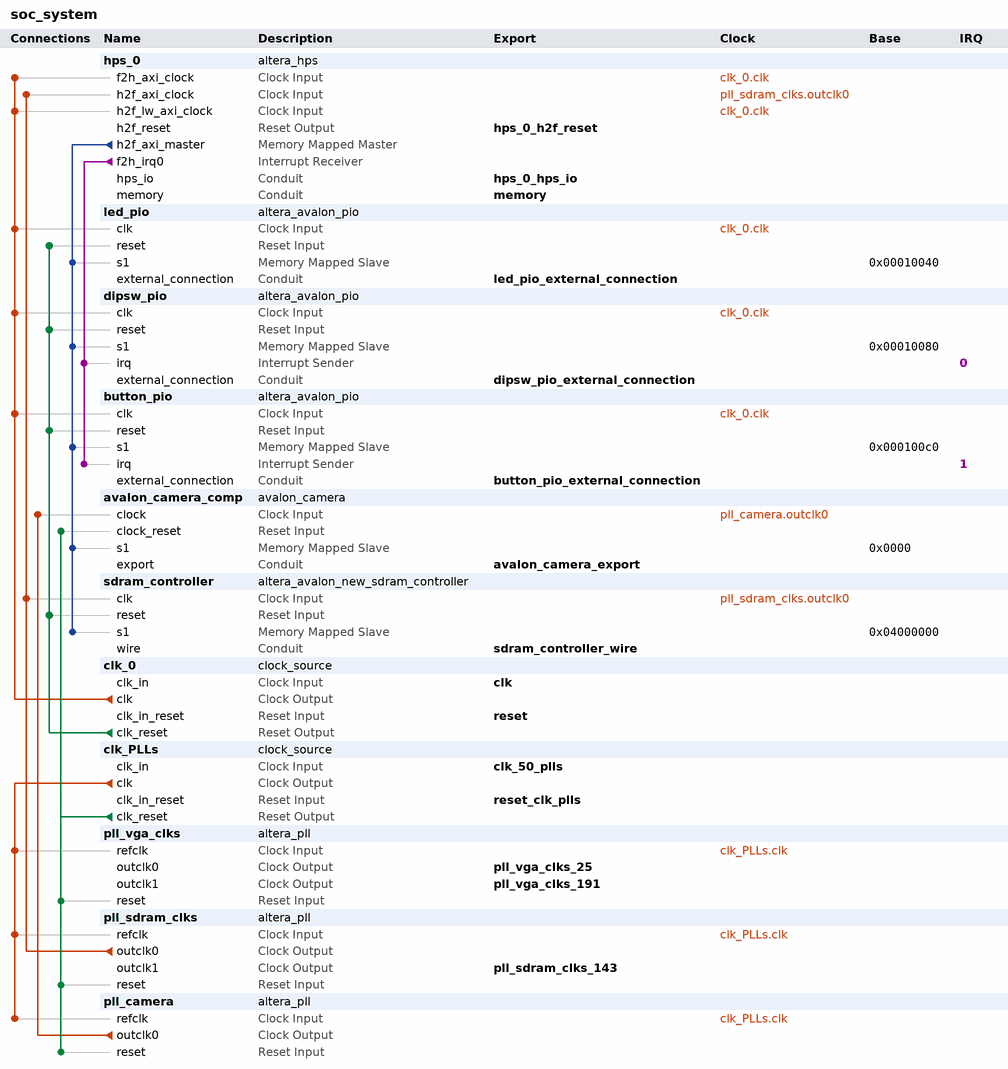
[diagram p0: system contents]
# Platform Designer (Qsys) system soc_system, Cyclone V 5CSEMA5F31C6
# Parameters at their usual value, and those the tool derives, are not listed.
package require -exact qsys 16.0
create_system soc_system
set_project_property DEVICE_FAMILY {Cyclone V}
set_project_property DEVICE 5CSEMA5F31C6

add_instance hps_0 altera_hps 16.0
set_instance_parameter_value hps_0 EMAC1_Mode RGMII
set_instance_parameter_value hps_0 EMAC1_PinMuxing {HPS I/O Set 0}
set_instance_parameter_value hps_0 F2SCLK_COLDRST_Enable false
set_instance_parameter_value hps_0 F2SCLK_DBGRST_Enable false
set_instance_parameter_value hps_0 F2SCLK_WARMRST_Enable false
set_instance_parameter_value hps_0 F2SINTERRUPT_Enable true
set_instance_parameter_value hps_0 F2S_Width 2
set_instance_parameter_value hps_0 FPGA_PERIPHERAL_OUTPUT_CLOCK_FREQ_EMAC0_GTX_CLK 100
set_instance_parameter_value hps_0 FPGA_PERIPHERAL_OUTPUT_CLOCK_FREQ_EMAC0_MD_CLK 100.0
set_instance_parameter_value hps_0 FPGA_PERIPHERAL_OUTPUT_CLOCK_FREQ_EMAC1_GTX_CLK 100
set_instance_parameter_value hps_0 FPGA_PERIPHERAL_OUTPUT_CLOCK_FREQ_EMAC1_MD_CLK 100.0
set_instance_parameter_value hps_0 HPS_PROTOCOL DDR3
set_instance_parameter_value hps_0 I2C0_Mode I2C
set_instance_parameter_value hps_0 I2C0_PinMuxing {HPS I/O Set 0}
set_instance_parameter_value hps_0 I2C1_Mode I2C
set_instance_parameter_value hps_0 I2C1_PinMuxing {HPS I/O Set 0}
set_instance_parameter_value hps_0 LWH2F_Enable true
set_instance_parameter_value hps_0 MEM_BANKADDR_WIDTH 3
set_instance_parameter_value hps_0 MEM_CLK_FREQ 400.0
set_instance_parameter_value hps_0 MEM_COL_ADDR_WIDTH 10
set_instance_parameter_value hps_0 MEM_DQ_WIDTH 32
set_instance_parameter_value hps_0 MEM_DRV_STR RZQ/7
set_instance_parameter_value hps_0 MEM_ROW_ADDR_WIDTH 15
set_instance_parameter_value hps_0 MEM_RTT_NOM RZQ/4
set_instance_parameter_value hps_0 MEM_RTT_WR RZQ/4
set_instance_parameter_value hps_0 MEM_TCL 11
set_instance_parameter_value hps_0 MEM_TFAW_NS 30.0
set_instance_parameter_value hps_0 MEM_TRAS_NS 35.0
set_instance_parameter_value hps_0 MEM_TRCD_NS 13.75
set_instance_parameter_value hps_0 MEM_TRFC_NS 260.0
set_instance_parameter_value hps_0 MEM_TRP_NS 13.75
set_instance_parameter_value hps_0 MEM_VENDOR Micron
set_instance_parameter_value hps_0 MEM_WTCL 8
set_instance_parameter_value hps_0 QSPI_Mode {1 SS}
set_instance_parameter_value hps_0 QSPI_PinMuxing {HPS I/O Set 0}
set_instance_parameter_value hps_0 REF_CLK_FREQ 25.0
set_instance_parameter_value hps_0 S2FCLK_USER2CLK 5
set_instance_parameter_value hps_0 S2F_Width 3
set_instance_parameter_value hps_0 SDIO_Mode {4-bit Data}
set_instance_parameter_value hps_0 SDIO_PinMuxing {HPS I/O Set 0}
set_instance_parameter_value hps_0 SPIM1_Mode {Single Slave Select}
set_instance_parameter_value hps_0 SPIM1_PinMuxing {HPS I/O Set 0}
set_instance_parameter_value hps_0 STM_Enable false
set_instance_parameter_value hps_0 TIMING_BOARD_AC_SKEW 0.02
set_instance_parameter_value hps_0 TIMING_BOARD_AC_TO_CK_SKEW 0.01
set_instance_parameter_value hps_0 TIMING_BOARD_DQ_TO_DQS_SKEW 0.05
set_instance_parameter_value hps_0 TIMING_BOARD_MAX_CK_DELAY 0.03
set_instance_parameter_value hps_0 TIMING_BOARD_MAX_DQS_DELAY 0.02
set_instance_parameter_value hps_0 TIMING_BOARD_SKEW_BETWEEN_DQS 0.06
set_instance_parameter_value hps_0 TIMING_BOARD_SKEW_CKDQS_DIMM_MAX 0.12
set_instance_parameter_value hps_0 TIMING_BOARD_SKEW_CKDQS_DIMM_MIN 0.06
set_instance_parameter_value hps_0 TIMING_BOARD_SKEW_WITHIN_DQS 0.01
set_instance_parameter_value hps_0 TIMING_TDH 65
set_instance_parameter_value hps_0 TIMING_TDQSCK 255
set_instance_parameter_value hps_0 TIMING_TDQSQ 125
set_instance_parameter_value hps_0 TIMING_TDS 30
set_instance_parameter_value hps_0 TIMING_TIH 140
set_instance_parameter_value hps_0 TIMING_TIS 180
set_instance_parameter_value hps_0 TIMING_TQSH 0.4
set_instance_parameter_value hps_0 UART0_Mode {No Flow Control}
set_instance_parameter_value hps_0 UART0_PinMuxing {HPS I/O Set 0}
set_instance_parameter_value hps_0 USB1_Mode SDR
set_instance_parameter_value hps_0 USB1_PinMuxing {HPS I/O Set 0}
set_instance_parameter_value hps_0 desired_cfg_clk_mhz 100.0
set_instance_parameter_value hps_0 desired_qspi_clk_mhz 400.0

add_instance led_pio altera_avalon_pio 16.0
set_instance_parameter_value led_pio direction Output
set_instance_parameter_value led_pio resetValue 15
set_instance_parameter_value led_pio width 10

add_instance dipsw_pio altera_avalon_pio 16.0
set_instance_parameter_value dipsw_pio bitClearingEdgeCapReg true
set_instance_parameter_value dipsw_pio captureEdge true
set_instance_parameter_value dipsw_pio direction Input
set_instance_parameter_value dipsw_pio edgeType ANY
set_instance_parameter_value dipsw_pio generateIRQ true
set_instance_parameter_value dipsw_pio irqType EDGE
set_instance_parameter_value dipsw_pio width 10

add_instance button_pio altera_avalon_pio 16.0
set_instance_parameter_value button_pio bitClearingEdgeCapReg true
set_instance_parameter_value button_pio captureEdge true
set_instance_parameter_value button_pio direction Input
set_instance_parameter_value button_pio edgeType FALLING
set_instance_parameter_value button_pio generateIRQ true
set_instance_parameter_value button_pio irqType EDGE
set_instance_parameter_value button_pio width 4

add_instance avalon_camera_comp avalon_camera 1.0
set_instance_parameter_value avalon_camera_comp COLUMN_MODE 17
set_instance_parameter_value avalon_camera_comp COLUMN_SIZE 2559
set_instance_parameter_value avalon_camera_comp EXPOSURE 1984
set_instance_parameter_value avalon_camera_comp HEIGHT 480
set_instance_parameter_value avalon_camera_comp ROW_MODE 17
set_instance_parameter_value avalon_camera_comp ROW_SIZE 1919
set_instance_parameter_value avalon_camera_comp START_COLUMN 0
set_instance_parameter_value avalon_camera_comp START_ROW 0
set_instance_parameter_value avalon_camera_comp WIDTH 640

add_instance sdram_controller altera_avalon_new_sdram_controller 16.0
set_instance_parameter_value sdram_controller TAC 5.4
set_instance_parameter_value sdram_controller TRCD 15.0
set_instance_parameter_value sdram_controller TRP 15.0
set_instance_parameter_value sdram_controller casLatency 3
set_instance_parameter_value sdram_controller columnWidth 10
set_instance_parameter_value sdram_controller dataWidth 16
set_instance_parameter_value sdram_controller generateSimulationModel false
set_instance_parameter_value sdram_controller model single_Micron_MT48LC4M32B2_7_chip
set_instance_parameter_value sdram_controller numberOfBanks 4
set_instance_parameter_value sdram_controller numberOfChipSelects 1
set_instance_parameter_value sdram_controller powerUpDelay 100.0
set_instance_parameter_value sdram_controller refreshPeriod 7.8125
set_instance_parameter_value sdram_controller rowWidth 13

add_instance clk_0 clock_source 16.0
set_instance_parameter_value clk_0 clockFrequency 50000000

add_instance clk_PLLs clock_source 16.0
set_instance_parameter_value clk_PLLs clockFrequency 50000000

add_instance pll_vga_clks altera_pll 16.0
set_instance_parameter_value pll_vga_clks gui_device_speed_grade 1
set_instance_parameter_value pll_vga_clks gui_number_of_clocks 2
set_instance_parameter_value pll_vga_clks gui_operation_mode direct
set_instance_parameter_value pll_vga_clks gui_output_clock_frequency0 25.175
set_instance_parameter_value pll_vga_clks gui_output_clock_frequency1 191.0
set_instance_parameter_value pll_vga_clks gui_pll_mode {Integer-N PLL}
set_instance_parameter_value pll_vga_clks gui_reference_clock_frequency 50.0
set_instance_parameter_value pll_vga_clks gui_use_locked false

add_instance pll_sdram_clks altera_pll 16.0
set_instance_parameter_value pll_sdram_clks gui_device_speed_grade 1
set_instance_parameter_value pll_sdram_clks gui_number_of_clocks 2
set_instance_parameter_value pll_sdram_clks gui_operation_mode normal
set_instance_parameter_value pll_sdram_clks gui_output_clock_frequency0 143.0
set_instance_parameter_value pll_sdram_clks gui_output_clock_frequency1 143.0
set_instance_parameter_value pll_sdram_clks gui_phase_shift1 -3800
set_instance_parameter_value pll_sdram_clks gui_pll_mode {Integer-N PLL}
set_instance_parameter_value pll_sdram_clks gui_reference_clock_frequency 50.0
set_instance_parameter_value pll_sdram_clks gui_use_locked false

add_instance pll_camera altera_pll 16.0
set_instance_parameter_value pll_camera gui_device_speed_grade 1
set_instance_parameter_value pll_camera gui_number_of_clocks 1
set_instance_parameter_value pll_camera gui_operation_mode direct
set_instance_parameter_value pll_camera gui_output_clock_frequency0 50.0
set_instance_parameter_value pll_camera gui_pll_mode {Integer-N PLL}
set_instance_parameter_value pll_camera gui_reference_clock_frequency 50.0
set_instance_parameter_value pll_camera gui_use_locked false

# connections
add_connection clk_0.clk button_pio.clk clock
add_connection clk_0.clk dipsw_pio.clk clock
add_connection clk_0.clk hps_0.f2h_axi_clock clock
add_connection clk_0.clk hps_0.h2f_lw_axi_clock clock
add_connection clk_0.clk led_pio.clk clock
add_connection clk_PLLs.clk pll_camera.refclk clock
add_connection clk_PLLs.clk pll_sdram_clks.refclk clock
add_connection clk_PLLs.clk pll_vga_clks.refclk clock
add_connection pll_camera.outclk0 avalon_camera_comp.clock clock
add_connection pll_sdram_clks.outclk0 hps_0.h2f_axi_clock clock
add_connection pll_sdram_clks.outclk0 sdram_controller.clk clock
add_connection clk_0.clk_reset button_pio.reset reset
add_connection clk_0.clk_reset dipsw_pio.reset reset
add_connection clk_0.clk_reset led_pio.reset reset
add_connection clk_0.clk_reset sdram_controller.reset reset
add_connection clk_PLLs.clk_reset avalon_camera_comp.clock_reset reset
add_connection clk_PLLs.clk_reset pll_camera.reset reset
add_connection clk_PLLs.clk_reset pll_sdram_clks.reset reset
add_connection clk_PLLs.clk_reset pll_vga_clks.reset reset
add_connection hps_0.h2f_axi_master avalon_camera_comp.s1 avalon
set_connection_parameter_value hps_0.h2f_axi_master/avalon_camera_comp.s1 baseAddress 0x0000
add_connection hps_0.h2f_axi_master button_pio.s1 avalon
set_connection_parameter_value hps_0.h2f_axi_master/button_pio.s1 baseAddress 0x000100c0
add_connection hps_0.h2f_axi_master dipsw_pio.s1 avalon
set_connection_parameter_value hps_0.h2f_axi_master/dipsw_pio.s1 baseAddress 0x00010080
add_connection hps_0.h2f_axi_master led_pio.s1 avalon
set_connection_parameter_value hps_0.h2f_axi_master/led_pio.s1 baseAddress 0x00010040
add_connection hps_0.h2f_axi_master sdram_controller.s1 avalon
set_connection_parameter_value hps_0.h2f_axi_master/sdram_controller.s1 baseAddress 0x04000000
add_connection hps_0.f2h_irq0 button_pio.irq interrupt
set_connection_parameter_value hps_0.f2h_irq0/button_pio.irq irqNumber 1
add_connection hps_0.f2h_irq0 dipsw_pio.irq interrupt
set_connection_parameter_value hps_0.f2h_irq0/dipsw_pio.irq irqNumber 0

# exported interfaces
add_interface avalon_camera_export conduit end
set_interface_property avalon_camera_export EXPORT_OF avalon_camera_comp.export
add_interface button_pio_external_connection conduit end
set_interface_property button_pio_external_connection EXPORT_OF button_pio.external_connection
add_interface clk clock sink
set_interface_property clk EXPORT_OF clk_0.clk_in
add_interface clk_50_plls clock sink
set_interface_property clk_50_plls EXPORT_OF clk_PLLs.clk_in
add_interface dipsw_pio_external_connection conduit end
set_interface_property dipsw_pio_external_connection EXPORT_OF dipsw_pio.external_connection
add_interface hps_0_h2f_reset reset source
set_interface_property hps_0_h2f_reset EXPORT_OF hps_0.h2f_reset
add_interface hps_0_hps_io conduit end
set_interface_property hps_0_hps_io EXPORT_OF hps_0.hps_io
add_interface led_pio_external_connection conduit end
set_interface_property led_pio_external_connection EXPORT_OF led_pio.external_connection
add_interface memory conduit end
set_interface_property memory EXPORT_OF hps_0.memory
add_interface pll_sdram_clks_143 clock source
set_interface_property pll_sdram_clks_143 EXPORT_OF pll_sdram_clks.outclk1
add_interface pll_vga_clks_191 clock source
set_interface_property pll_vga_clks_191 EXPORT_OF pll_vga_clks.outclk1
add_interface pll_vga_clks_25 clock source
set_interface_property pll_vga_clks_25 EXPORT_OF pll_vga_clks.outclk0
add_interface reset reset sink
set_interface_property reset EXPORT_OF clk_0.clk_in_reset
add_interface reset_clk_plls reset sink
set_interface_property reset_clk_plls EXPORT_OF clk_PLLs.clk_in_reset
add_interface sdram_controller_wire conduit end
set_interface_property sdram_controller_wire EXPORT_OF sdram_controller.wire

set_interconnect_requirement {$system} qsys_mm.clockCrossingAdapter HANDSHAKE
set_interconnect_requirement {$system} qsys_mm.maxAdditionalLatency 1

save_system soc_system.qsys
